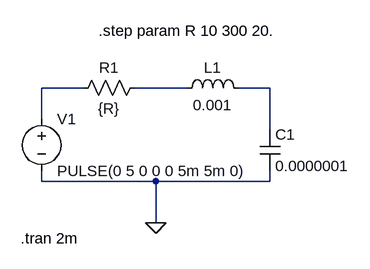
[diagram p0: schematic 2021326.asc]
2021326.asc, the LTspice schematic file:
Version 4
SHEET 1 880 680
WIRE 96 96 32 96
WIRE 256 96 176 96
WIRE 384 96 336 96
WIRE 32 144 32 96
WIRE 384 160 384 96
WIRE 32 240 32 224
WIRE 208 240 32 240
WIRE 384 240 384 224
WIRE 384 240 208 240
WIRE 208 304 208 240
FLAG 208 304 0
SYMBOL voltage 32 128 R0
WINDOW 123 0 0 Left 0
WINDOW 39 0 0 Left 0
SYMATTR InstName V1
SYMATTR Value PULSE(0 5 0 0 0 5m 5m 0)
SYMBOL res 192 80 R90
WINDOW 0 0 56 VBottom 2
WINDOW 3 32 56 VTop 2
SYMATTR InstName R1
SYMATTR Value {R}
SYMBOL ind 240 112 R270
WINDOW 0 32 56 VTop 2
WINDOW 3 5 56 VBottom 2
SYMATTR InstName L1
SYMATTR Value 0.001
SYMBOL cap 368 160 R0
SYMATTR InstName C1
SYMATTR Value 0.0000001
SYMATTR SpiceLine Rser=3.5
TEXT 120 8 Left 2 !.step param R 10 300 20.
TEXT 0 328 Left 2 !.tran 2m

The netlist it stands for:
* 2021326.asc
V1 N001 0 PULSE(0 5 0 0 0 5m 5m 0)
R1 N002 N001 {R}
L1 N002 N003 0.001
C1 N003 0 0.0000001 Rser=3.5
.step param R 10 300 20.
.tran 2m
.backanno
.end